# EAGLE schematic SectionA_Schematic (EAGLE 9.3.0)
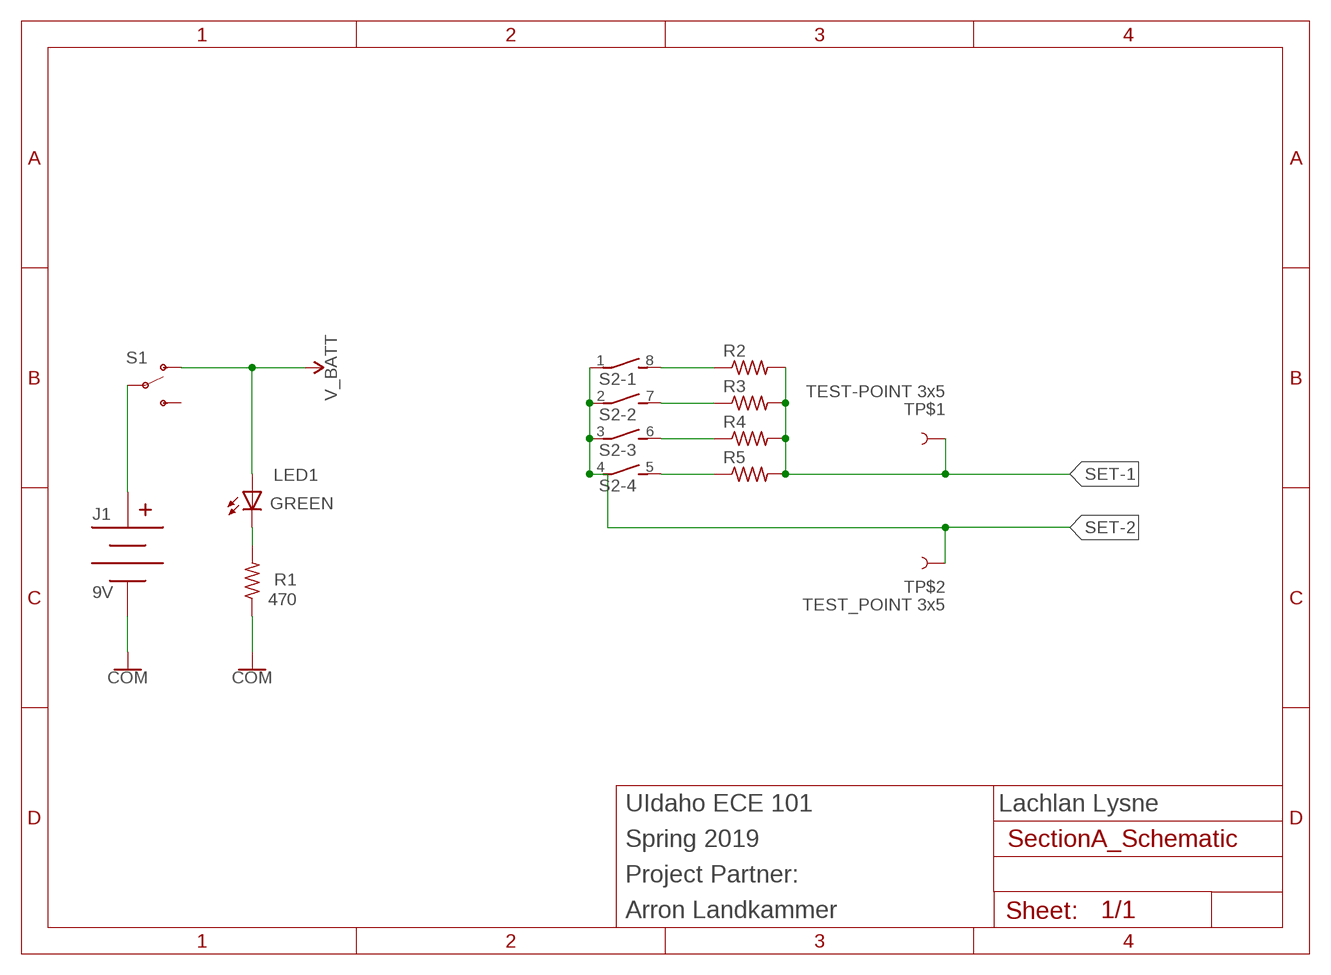
[diagram p0: schematic, sheet 1]

## Parts
J1  9V  SPARKFUN-CONNECTORS_BC9VPC  [SPARKFUN-CONNECTORS_BC9VPC]
LED1  ADAFRUIT_LED5MM  [ADAFRUIT_LED5MM]
R1  470  ADAFRUIT_R-US_0207/10  [ADAFRUIT_0207/10]
R2  ADAFRUIT_R-US_0207/10  [ADAFRUIT_0207/10]
R3  ADAFRUIT_R-US_0207/10  [ADAFRUIT_0207/10]
R4  ADAFRUIT_R-US_0207/10  [ADAFRUIT_0207/10]
R5  ADAFRUIT_R-US_0207/10  [ADAFRUIT_0207/10]
S1  SPARKFUN-SWITCHES_SWITCH-SPDT-PTH-11.6X4.0MM  [SPARKFUN-SWITCHES_SWITCH_SPDT_PTH_11.6X4.0MM]
S2  SWITCH-DIL_DIP04S  [SWITCH-DIL_DIP04S]
TP$1  TEST-POINT 3x5  SPARKFUN-CONNECTORS_TEST-POINT3X5  [SPARKFUN-CONNECTORS_PAD.03X.05]
TP$2  TEST_POINT 3x5  SPARKFUN-CONNECTORS_TEST-POINT3X5  [SPARKFUN-CONNECTORS_PAD.03X.05]

## Nets
GND: J1.V- R1.1 ; supply symbol labelled COM
N$1: J1.V+ S1.2(P)
N$2: LED1.K(C) R1.2
N$3: R2.1 S2.8
N$4: R3.1 S2.7
N$5: R4.1 S2.6
N$6: R5.1 S2.5
SET-1: R2.2 R3.2 R4.2 R5.2 TP$1.P$1
SET-2: S2.1 S2.2 S2.3 S2.4 TP$2.P$1
V_BATT: LED1.A S1.1(O)
Unconnected: S1.3(S)

## Notes on the sheet
- UIdaho ECE 101 | Lachlan Lysne
- Spring 2019
- Project Partner:
- Arron Landkammer

## Library data of the parts
J1 = SECTION A:SPARKFUN-CONNECTORS_BC9VPC: 9V Battery Holder - PC Mount Standard and Kit footprints included SparkFun Products: SparkFun SparkPunk Sound Kit <https://www.sparkfun.com/products/11177> SparkFun SparkPunk Sequencer Kit <https://www.sparkfun.com/products/12707>; PROD_ID: BATT-10855
LED1 = SECTION A:ADAFRUIT_LED: LED OSRAM: - CHIPLED LG R971, LG N971, LY N971, LG Q971, LY Q971, LO R971, LY R971 LH N974, LH R974 LS Q976, LO Q976, LY Q976 LO Q996 - Hyper CHIPLED LW Q18S LB Q993, LB Q99A, LB R99A - SideLED LS A670, LO A670, LY A670, LG A670, LP A670 LB A673, LV A673, LT A673, LW A673 LH A674 LY A675 LS A676, LA A676, LO A676, LY A676, LW A676 LS A679, LY A679, LG A679 - Hyper Micro SIDELED® LS Y876, LA Y876, LO Y876, LY Y876 LT Y87S - SmartLED LW L88C, LW L88S LB L89C, LB L89S, LG L890 LS L89K, LO L89K, LY L89K LS L896, LA L896, LO L896, LY L896 - TOPLED LS T670, LO T670, LY T670, LG T670, LP T670 LSG T670, LSP T670, LSY T670, LOP T670, LYG T670 LG T671, LOG T671, LSG T671 LB T673, LV T673, LT T673, LW T673 LH T674 LS T676, LA T676, LO T676, LY T676, LB T676, LH T676, LSB T676, LW T676 LB T67C, LV T67C, LT T67C, LS T67K, LO T67K, LY T67K, LW E67C LS E67B, LA E67B, LO E67B, LY E67B, LB E67C, LV E67C, LT E67C LW T67C LS T679, LY T679, LG T679 LS T770, LO T770, LY T770, LG T770, LP T770 LB T773, LV T773, LT T773, LW T773 LH T774 LS E675, LA E675, LY E675, LS T675 LS T776, LA T776, LO T776, LY T776, LB T776 LHGB T686 LT T68C, LB T68C - Hyper Mini TOPLED® LB M676 - Mini TOPLED Santana® LG M470 LS M47K, LO M47K, LY M47K Source: http://www.osram.convergy.de/; COLOR: GREEN
R1-R5 = SECTION A:ADAFRUIT_R-US_: RESISTOR, American symbol
S1 = SECTION A:SPARKFUN-SWITCHES_SWITCH-SPDT: Single Pole, Double Throw (SPDT) Switch Single-pole, double-throw (SPDT) switch. Variant Overview SMD-AYZ0202 Surface Mount DPDT Switch <https://www.sparkfun.com/products/597> (COM-00597) Used on e.g. LilyPad Arduino USB - ATmega32U4 Board <https://www.sparkfun.com/products/12049> PTH-11.6X4.0MM SPDT Mini Power Switch <https://www.sparkfun.com/products/102> (COM-00102) Used on e.g. SparkFun Simon Says - Through-Hole Soldering Kit <https://www.sparkfun.com/products/10547> (KIT-10547) PTH-11.6X4.0MM-KIT KIT version of SPDT Mini Power Switch - Simplifies soldering by removing tStop of switch pins - only one side can be soldered. PTH-11.6X4.0MM-LOCK LOCK version of SPDT Mini Power Switch - Offset pins hold switch in place for easier soldering. SMD-RIGHT-ANGLE Surface Mount Right Angle Switch <https://www.sparkfun.com/products/10860> (COM-10860) Used on e.g. SparkFun ESP8266 Thing <https://www.sparkfun.com/products/13231>; PROD_ID: SWCH-10651; SF_ID: COM-00597; SF_SKU: COM-10860
S2 = SECTION A:SWITCH-DIL_DIP04S: DIL/CODE SWITCH; OC_FARNELL: unknown; OC_NEWARK: unknown
TP$1 TP$2 = SECTION A:SPARKFUN-CONNECTORS_TEST-POINT: SparkFun Test Points Bare copper test points for troubleshooting or In-Circuit-Testing. These are used by our Production team for verifying production board runs using pogo-pins on test beds. SparkFun Products: SparkFun LSM9DS1 Breakout <https://www.sparkfun.com/products/13284> SparkFun PSOC <https://www.sparkfun.com/products/13714> SparkFun Load Cell Amplifier <https://www.sparkfun.com/products/13879>